# EAGLE schematic BBiQ-1.1 (EAGLE 9.1.1)
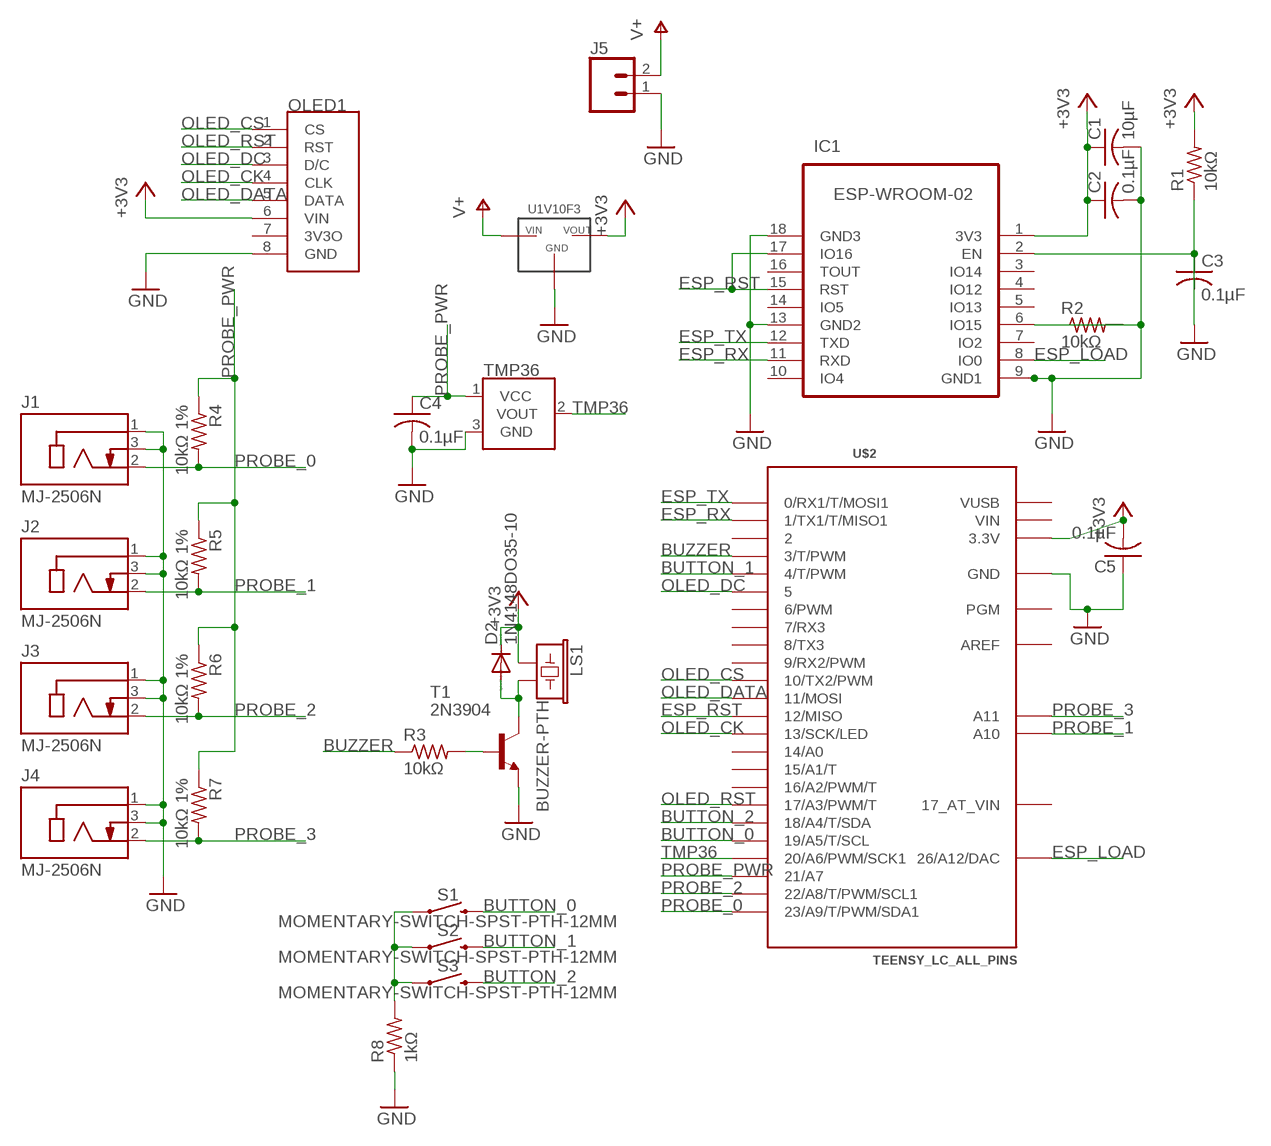
[diagram p0: schematic, sheet 1]

## Parts
C1  10µF  C-US025-025X050  [C025-025X050]
C2  0.1µF  C-US025-025X050  [C025-025X050]
C3  0.1µF  C-US025-025X050  [C025-025X050]
C4  0.1µF  C-US025-025X050  [C025-025X050]
C5  0.1µF  C-US025-025X050  [C025-025X050]
D2  1N4148DO35-10  [DO35-10]
IC1  ESP-WROOM-02  [ESP-WROOM-02]
J1  MJ-2506N  [CUI_MJ-2506N]
J2  MJ-2506N  [CUI_MJ-2506N]
J3  MJ-2506N  [CUI_MJ-2506N]
J4  MJ-2506N  [CUI_MJ-2506N]
J5  CONN_02JST-PTH-2  [JST-2-PTH]
LS1  BUZZER-PTH  [BUZZER-12MM]
OLED1  ADAFRUIT_128X32_SPI_OLED  [ADAFRUIT_128X32_SPI_OLED]
R1  10kΩ  R-US_0204/5  [0204/5]
R2  10kΩ  R-US_0204/5  [0204/5]
R3  10kΩ  R-US_0204/5  [0204/5]
R4  10kΩ 1%  R-US_0204/5  [0204/5]
R5  10kΩ 1%  R-US_0204/5  [0204/5]
R6  10kΩ 1%  R-US_0204/5  [0204/5]
R7  10kΩ 1%  R-US_0204/5  [0204/5]
R8  1kΩ  R-US_0204/5  [0204/5]
S1  MOMENTARY-SWITCH-SPST-PTH-12MM  [TACTILE_SWITCH_PTH_12MM]
S2  MOMENTARY-SWITCH-SPST-PTH-12MM  [TACTILE_SWITCH_PTH_12MM]
S3  MOMENTARY-SWITCH-SPST-PTH-12MM  [TACTILE_SWITCH_PTH_12MM]
T1  2N3904  [TO92]
TMP36  TMP36GT9  [TO-92]
U$1  U1V10F3  [U1V10F3]
U$2  TEENSY_LC_ALL_PINS  [TEENSY_3.0-3.2&LC_ALL_PINS]

## Nets
+3V3: C1.1 C2.1 C5.2 D2.C IC1.1(3V3) LS1.+ OLED1.6(VIN) R1.2 U$1.VOUT U$2.3.3V U$2.3.3V1(3.3V)
BUTTON_0: S1.3 S1.4 U$2.19/A5(19/A5/T/SCL)
BUTTON_1: S2.3 S2.4 U$2.4(4/T/PWM)
BUTTON_2: S3.3 S3.4 U$2.18/A4(18/A4/T/SDA)
BUZZER: R3.1 U$2.3(3/T/PWM)
ESP_LOAD: IC1.8(IO0) U$2.RESET/DAC(26/A12/DAC)
ESP_RST: IC1.15(RST) IC1.17(IO16) U$2.12(12/MISO)
ESP_RX: IC1.11(RXD) U$2.1(1/TX1/T/MISO1)
ESP_TX: IC1.12(TXD) U$2.0(0/RX1/T/MOSI1)
GND: C1.2 C2.2 C3.1 C4.2 C5.1 IC1.9(GND1) IC1.13(GND2) IC1.18(GND3) IC1.19(GND0) J1.1 J1.3 J2.1 J2.3 J3.1 J3.3 J4.1 J4.3 J5.1 OLED1.8(GND) R2.1 R8.1 T1.3(E) TMP36.3(GND) U$1.GND U$2.AGND(GND) U$2.GND U$2.GND1(GND)
N$2: C3.2 IC1.2(EN) R1.1
N$3: IC1.6(IO15) R2.2
N$4: R3.2 T1.2(B)
N$6: D2.A LS1.- T1.1(C)
N$7: R8.2 S1.1 S1.2 S2.1 S2.2 S3.1 S3.2
OLED_CK: OLED1.4(CLK) U$2.13(13/SCK/LED)
OLED_CS: OLED1.1(CS) U$2.10(10/TX2/PWM)
OLED_DATA: OLED1.5(DATA) U$2.11(11/MOSI)
OLED_DC: OLED1.3(D/C) U$2.5
OLED_RST: OLED1.2(RST) U$2.17/A3(17/A3/PWM/T)
PROBE_0: J1.2 R4.2 U$2.23/A9(23/A9/T/PWM/SDA1)
PROBE_1: J2.2 R5.2 U$2.A10
PROBE_2: J3.2 R6.2 U$2.22/A8(22/A8/T/PWM/SCL1)
PROBE_3: J4.2 R7.2 U$2.A11
PROBE_PWR: C4.1 R4.1 R5.1 R6.1 R7.1 TMP36.1(VCC) U$2.21/A7
TMP36: TMP36.2(VOUT) U$2.20/A6(20/A6/PWM/SCK1)
VBAT: J5.2 U$1.VIN ; supply symbol labelled V+
Unconnected: IC1.3(IO14) IC1.4(IO12) IC1.5(IO13) IC1.7(IO2) IC1.10(IO4) IC1.14(IO5) IC1.16(TOUT) U$2.2 U$2.6(6/PWM) U$2.7(7/RX3) U$2.8(8/TX3) U$2.9(9/RX2/PWM) U$2.14/A0 U$2.15/A1(15/A1/T) U$2.16/A2(16/A2/PWM/T) U$2.PGM U$2.VBAT(17_AT_VIN)

## Power pins joined to a net without a drawn wire
3V3O: OLED1.7(3V3O)
AREF: U$2.AREF
VIN: U$2.VIN
VUSB: U$2.VUSB

## Library data of the parts
C1-C5 = resistor:C-US: CAPACITOR, American symbol
D2 = diode:1N4148: DIODE high speed (Philips)
IC1 = esp-wroom-02:ESP-WROOM-02: WiFi module - ESP-WROOM-02
J1-J4 = MJ-2506N:MJ-2506N: 2.5 mm, Mono, Right Angle, Through Hole, Audio Jack Connector; MANUFACTURER: CUI INC; PART_REV: E; STANDARD: MANUFACTURER RECOMMENDATIONS
J5 = SparkFun-Connectors:CONN_02: Multi connection point. Often used as Generic Header-pin footprint for 0.1 inch spaced/style header connections On any of the 0.1 inch spaced packages, you can populate with these: Break Away Headers - Straight <https://www.sparkfun.com/products/116> (PRT-00116) Break Away Male Headers - Right Angle <https://www.sparkfun.com/products/553> (PRT-00553) Female Headers <https://www.sparkfun.com/products/115> (PRT-00115) Break Away Headers - Machine Pin <https://www.sparkfun.com/products/117> (PRT-00117) Break Away Female Headers - Swiss Machine Pin <https://www.sparkfun.com/products/743> (PRT-00743) For SCREWTERMINALS and SPRING TERMINALS visit here: Screw Terimnals on SparkFun.com <https://www.sparkfun.com/search/results?term=Screw+Terminals> (5mm/3.5mm/2.54mm spacing) This device is also useful as a general connection point to wire up your design to another part of your project. Our various solder wires solder well into these plated through hole pads. Hook-Up Wire - Assortment (Stranded, 22 AWG) <https://www.sparkfun.com/products/11375> (PRT-11375) Hook-Up Wire - Assortment (Solid Core, 22 AWG) <https://www.sparkfun.com/products/11367> (PRT-11367) View the entire wire category on our website here <https://www.sparkfun.com/categories/141> Special notes: Molex polarized connector foot print use with: PRT-08233 with associated crimp pins and housings. 2.54_SCREWTERM for use with PRT-10571. 3.5mm Screw Terminal footprints for PRT-08084 5mm Screw Terminal footprints for use with PRT-08432; PROD_ID: CONN-09863; SKU: PRT-09914
LS1 = SparkFun-Electromechanical:BUZZER: Buzzer Small round buzzers that operate around the audible 2kHz range. You can use these as speakers to create simple music or user interfaces. Variant Overview: PTH - Mini Speaker - PC Mount 12mm 2.048kHz <https://www.sparkfun.com/products/7950> PTH_KIT - Mini Speaker - PC Mount 12mm 2.048kHz <https://www.sparkfun.com/products/7950> KIT simplifies soldering by adding stop mask to one side of the pads. PTH_NO_SILK - Mini Speaker - PC Mount 12mm 2.048kHz <https://www.sparkfun.com/products/7950> No silkscreen indicator of buzzer outline. PTH_KIT_NO_SILK - Mini Speaker - PC Mount 12mm 2.048kHz <https://www.sparkfun.com/products/7950> KIT package w/o silkscreen SMD - Buzzer Audio Magnetic (CCV-084B16) SMD buzzer used on, e.g. the LilyPad Buzzer <https://www.sparkfun.com/products/8463> and RFID USB Reader <https://www.sparkfun.com/products/9963>. SMD_KIT - Buzzer Audio Magnetic (CCV-084B16) SMD Buzzer with elongated pins to make soldering easier. Used on the SparkFun Simon Says - Surface Mount Soldering Kit <https://www.sparkfun.com/products/10935>.; PROD_ID: COMP-08253; SF_SKU: COM-07950
OLED1 = Adafruit OLED 128x32 Mono:ADAFRUIT_128X32_SPI_OLED
R1-R8 = resistor:R-US_: RESISTOR, American symbol
S1-S3 = SparkFun-Switches:MOMENTARY-SWITCH-SPST: Momentary Switch (Pushbutton) - SPST Normally-open (NO) SPST momentary switches (buttons, pushbuttons). Variants PTH-12MM - 12mm square, through-hole Momentary Pushbutton Switch - 12mm Square <https://www.sparkfun.com/products/9190> (COM-09190) PTH-6.0MM, PTH-6.0MM-KIT - 6.0mm square, through-hole Mini Pushbutton Switch <https://www.sparkfun.com/products/97> (COM-00097) KIT package intended for soldering kit's - only one side of pads' copper is exposed. PTH-RIGHT-ANGLE-KIT - Right-angle, through-hole Right Angle Tactile Button <https://www.sparkfun.com/products/10791> - Used on SparkFun BigTime Watch Kit <https://www.sparkfun.com/products/11734> SMD-12MM - 12mm square, surface-mount Tactile Button - SMD (12mm) <https://www.sparkfun.com/products/12993> (COM-12993) Used on SparkFun PicoBoard <https://www.sparkfun.com/products/11888> SMD-4.5MM - 4.5mm Square Trackball Switch Used on SparkFun Blackberry Trackballer Breakout <https://www.sparkfun.com/products/13169> SMD-4.6MMX2.8MM - 4.60mm x 2.80mm, surface mount Used on SparkFun SAMD21 Mini Breakout <https://www.sparkfun.com/products/13664> SMD-5.2MM, SMD-5.2-REDUNDANT - 5.2mm square, surface-mount Mini Pushbutton Switch - SMD <https://www.sparkfun.com/products/8720> (COM-08720) Used on Arduino Pro Mini <https://www.sparkfun.com/products/11114> REDUNDANT package connects both switch circuits together SMD-6.0X3.5MM - 6.0 x 3.5mm, surface mount Momentary Reset Switch SMD <https://www.sparkfun.com/products/8229> (COM-08229) SMD-6.2MM-TALL - 6.2mm square, surface mount Tactile Button - SMD (6mm) <https://www.sparkfun.com/products/12992> Used on SparkFun Digital Sandbox <https://www.sparkfun.com/products/12651> SMD-RIGHT-ANGLE - Right-angle, surface mount Used on SparkFun Block for Intel® Edison - Arduino <https://www.sparkfun.com/products/13036>; PROD_ID: SWCH-09185; SF_SKU: COM-09190
T1 = transistor:2N3904: NPN TRANSISTOR
TMP36 = SparkFun-Sensors:TMP36: TMP36 Precision Analog °C Temperature Sensor The TMP36 is a low voltage, precision centigrade temperature sensor. It provides a voltage output that is linearly proportional to the Celsius temperature. It also doesn’t require any external calibration to provide typical accuracies of ±1°C at +25°C and ±2°C over the −40°C to +125°C temperature range. We like it because it’s so easy to use: Just give the device a ground and 2.7 to 5.5 VDC and read the voltage on the Vout pin. The output voltage can be converted to temperature easily using the scale factor of 10 mV/°C. Datasheet <http://cdn.sparkfun.com/datasheets/Sensors/Temp/TMP35_36_37.pdf> SparkFun Products Temperature Sensor - TMP36 <https://www.sparkfun.com/products/10988> (SEN-10988) SparkFun Danger Shield <https://www.sparkfun.com/products/11649> (DEV-11649); PROD_ID: IC-09880; SF_ID: SEN-10988
U$1 = U1V10F3:U1V10F3: U1V10F3 3.3 Volt Spannungsregler-Board Pololu
U$2 = Teensy_3_and_LC_Series_Boards_v1.4:TEENSY_LC_ALL_PINS: Teensy LC board with all pins used.